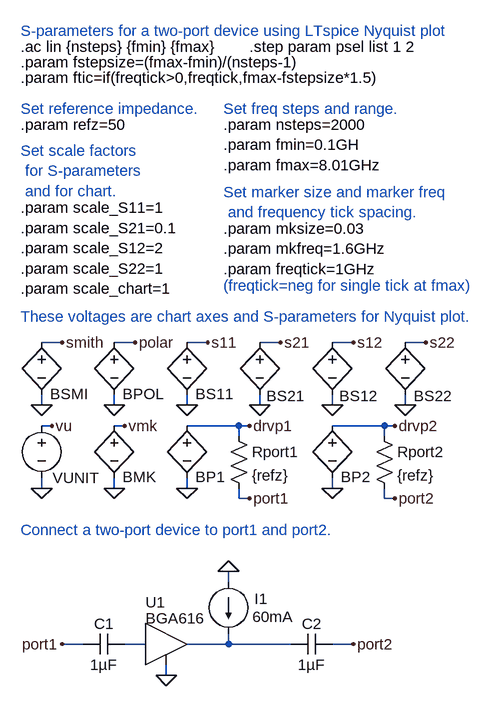
[diagram p0: schematic smith.asc]
smith.asc, the LTspice schematic file:
Version 4
SHEET 1 1520 4196
WIRE -240 2352 -272 2352
WIRE -128 2352 -160 2352
WIRE -16 2352 -48 2352
WIRE 96 2352 64 2352
WIRE 208 2352 176 2352
WIRE 320 2352 288 2352
WIRE -272 2448 -272 2432
WIRE -160 2448 -160 2432
WIRE -48 2448 -48 2432
WIRE 64 2448 64 2432
WIRE 176 2448 176 2432
WIRE 288 2448 288 2432
WIRE -256 2480 -272 2480
WIRE -144 2480 -160 2480
WIRE 32 2480 -48 2480
WIRE 48 2480 32 2480
WIRE 256 2480 176 2480
WIRE 272 2480 256 2480
WIRE 32 2496 32 2480
WIRE 256 2496 256 2480
WIRE -272 2576 -272 2560
WIRE -160 2576 -160 2560
WIRE -48 2576 -48 2560
WIRE 176 2576 176 2560
WIRE 32 2592 32 2576
WIRE 48 2592 32 2592
WIRE 256 2592 256 2576
WIRE 272 2592 256 2592
WIRE 16 2720 16 2704
WIRE -208 2816 -240 2816
WIRE -112 2816 -144 2816
WIRE 16 2816 16 2800
WIRE 16 2816 -48 2816
WIRE 112 2816 16 2816
WIRE 208 2816 176 2816
WIRE -80 2864 -80 2848
FLAG 48 2592 port1
FLAG 272 2592 port2
FLAG 48 2480 drvp1
FLAG 272 2480 drvp2
FLAG -272 2576 0
FLAG -48 2448 0
FLAG -16 2352 s11
FLAG 176 2448 0
FLAG 208 2352 s12
FLAG 64 2448 0
FLAG 96 2352 s21
FLAG 288 2448 0
FLAG 320 2352 s22
FLAG -160 2576 0
FLAG -144 2480 vmk
FLAG -48 2576 0
FLAG 176 2576 0
FLAG -256 2480 vu
FLAG 208 2816 port2
FLAG -240 2816 port1
FLAG -80 2864 0
FLAG 16 2704 0
FLAG -240 2352 smith
FLAG -272 2448 0
FLAG -128 2352 polar
FLAG -160 2448 0
SYMBOL voltage -272 2464 R0
WINDOW 0 17 96 Left 0
WINDOW 39 17 124 Left 0
SYMATTR InstName VUNIT
SYMATTR Value2 AC 1V 0
SYMATTR Value ""
SYMBOL res 240 2480 R0
SYMATTR InstName Rport2
SYMATTR Value {refz}
SYMBOL bv -48 2336 R0
WINDOW 0 13 95 Left 0
WINDOW 3 24 104 Invisible 0
SYMATTR InstName BS11
SYMATTR Value V=if(abs(psel-1),0,scale_S11*(2*V(port1)-V(drvp1))+V(vmk))
SYMBOL bv 176 2336 R0
WINDOW 0 11 98 Left 0
WINDOW 3 24 104 Invisible 0
SYMATTR InstName BS12
SYMATTR Value V=if(abs(psel-2),0,scale_S12*(2*V(port1)-V(drvp1))+V(vmk))
SYMBOL bv 64 2336 R0
WINDOW 0 10 98 Left 0
WINDOW 3 24 104 Invisible 0
SYMATTR InstName BS21
SYMATTR Value V=if(abs(psel-1),0,scale_S21*(2*V(port2)-V(drvp2))+V(vmk))
SYMBOL bv 288 2336 R0
WINDOW 0 13 98 Left 0
WINDOW 3 24 104 Invisible 0
SYMATTR InstName BS22
SYMATTR Value V=if(abs(psel-2),0,scale_S22*(2*V(port2)-V(drvp2))+V(vmk))
SYMBOL bv -160 2464 R0
WINDOW 0 13 95 Left 0
WINDOW 3 24 104 Invisible 0
SYMATTR InstName BMK
SYMATTR Value V=V(vu)*max(0,{mksize}) laplace=0.5*((1-((sqrt(-1)*2*pi*{mkfreq-fstepsize}/s)-1)/abs((sqrt(-1)*2*pi*{mkfreq-fstepsize}/s)-1)*((sqrt(-1)*2*pi*{mkfreq}/s)-1)/abs((sqrt(-1)*2*pi*{mkfreq}/s)-1))+sqrt(-1)*(1-((sqrt(-1)*2*pi*{mkfreq}/s)-1)/abs((sqrt(-1)*2*pi*{mkfreq}/s)-1)*((sqrt(-1)*2*pi*{mkfreq+fstepsize}/s)-1)/abs((sqrt(-1)*2*pi*{mkfreq+fstepsize}/s)-1)))-0.25*((1-sin((s/sqrt(-1))/{2*ftic})/abs(sin((s/sqrt(-1))/{2*ftic}))*sin((s/sqrt(-1)+{2*pi*fstepsize})/{2*ftic})/abs(sin((s/sqrt(-1)+{2*pi*fstepsize})/{2*ftic})))+sqrt(-1)*(1-sin((s/sqrt(-1))/{2*ftic})/abs(sin((s/sqrt(-1))/{2*ftic}))*sin((s/sqrt(-1)-{2*pi*fstepsize})/{2*ftic})/abs(sin((s/sqrt(-1)-{2*pi*fstepsize})/{2*ftic}))))
SYMBOL res 16 2480 R0
SYMATTR InstName Rport1
SYMATTR Value {refz}
SYMBOL bv -48 2464 R0
WINDOW 0 13 95 Left 0
WINDOW 3 24 104 Invisible 0
SYMATTR InstName BP1
SYMATTR Value V=if(abs({psel}-1),0V,V(vu))
SYMBOL bv 176 2464 R0
WINDOW 0 13 95 Left 0
WINDOW 3 24 104 Invisible 0
SYMATTR InstName BP2
SYMATTR Value V=if(abs({psel}-2),0V,V(vu))
SYMBOL bv -272 2336 R0
WINDOW 0 13 95 Left 0
WINDOW 3 24 104 Invisible 0
SYMATTR InstName BSMI
SYMATTR Value V=V(vu)*{scale_chart}*0.99999999999 laplace=(2-{psel})*(((cos((pi/36)*(s/(sqrt(-1)*2*pi)-{fmin})/({fstepsize}))+sqrt(-1)*sin((pi/36)*(s/(sqrt(-1)*2*pi)-{fmin})/({fstepsize})))*(3-abs((s/(sqrt(-1)*2*pi)-{fmin})/({fstepsize})-72)/((s/(sqrt(-1)*2*pi)-{fmin})/({fstepsize})-72))/4+(1+abs((s/(sqrt(-1)*2*pi)-{fmin})/({fstepsize})-72)/((s/(sqrt(-1)*2*pi)-{fmin})/({fstepsize})-72))/4)*(1-abs((s/(sqrt(-1)*2*pi)-{fmin})/({fstepsize})-144)/((s/(sqrt(-1)*2*pi)-{fmin})/({fstepsize})-144))/2-(1+abs((s/(sqrt(-1)*2*pi)-{fmin})/({fstepsize})-144)/((s/(sqrt(-1)*2*pi)-{fmin})/({fstepsize})-144))/2)+({psel}-1)*(((1-abs(cos((pi/36)*(s/(sqrt(-1)*2*pi)-{fmin})/({fstepsize}))))+sqrt(-1)*(1-sin((pi/36)*(s/(sqrt(-1)*2*pi)-{fmin})/({fstepsize})))*abs((s/(sqrt(-1)*2*pi)-{fmin})/({fstepsize})-17.5)/((s/(sqrt(-1)*2*pi)-{fmin})/({fstepsize})-17.5))*(1-abs((s/(sqrt(-1)*2*pi)-{fmin})/({fstepsize})-35.5)/((s/(sqrt(-1)*2*pi)-{fmin})/({fstepsize})-35.5))/2+sqrt(-1)*(1+abs((s/(sqrt(-1)*2*pi)-{fmin})/({fstepsize})-35.5)/((s/(sqrt(-1)*2*pi)-{fmin})/({fstepsize})-35.5))/2)
SYMBOL BGA616 -80 2752 R0
SYMATTR InstName U1
SYMBOL current 16 2720 R0
WINDOW 0 40 26 Left 0
WINDOW 3 37 54 Left 0
WINDOW 123 0 0 Left 0
WINDOW 39 0 0 Left 0
SYMATTR InstName I1
SYMATTR Value 60mA
SYMBOL cap -144 2800 R90
WINDOW 0 0 32 VBottom 0
WINDOW 3 32 32 VTop 0
SYMATTR InstName C1
SYMATTR Value 1µF
SYMBOL cap 176 2800 R90
WINDOW 0 0 32 VBottom 0
WINDOW 3 32 32 VTop 0
SYMATTR InstName C2
SYMATTR Value 1µF
SYMBOL bv -160 2336 R0
WINDOW 0 13 95 Left 0
WINDOW 3 24 104 Invisible 0
SYMATTR InstName BPOL
SYMATTR Value V=V(vu)*({scale_chart}/{psel}) laplace=(cos((pi/36)*(s/(sqrt(-1)*2*pi)-{fmin})/({fstepsize}))+sqrt(-1)*sin((pi/36)*(s/(sqrt(-1)*2*pi)-{fmin})/({fstepsize})))*(1-abs((s/(sqrt(-1)*2*pi)-{fmin})/({fstepsize})-72.5)/((s/(sqrt(-1)*2*pi)-{fmin})/({fstepsize})-72.5))/2-(1-abs((s/(sqrt(-1)*2*pi)-{fmin})/({fstepsize})-72.5)/((s/(sqrt(-1)*2*pi)-{fmin})/({fstepsize})-72.5)*abs((s/(sqrt(-1)*2*pi)-{fmin})/({fstepsize})-73.5)/((s/(sqrt(-1)*2*pi)-{fmin})/({fstepsize})-73.5))/2+sqrt(-1)*abs((s/(sqrt(-1)*2*pi)-{fmin})/({fstepsize})-75.5)/((s/(sqrt(-1)*2*pi)-{fmin})/({fstepsize})-75.5)*(1-abs((s/(sqrt(-1)*2*pi)-{fmin})/({fstepsize})-74.5)/((s/(sqrt(-1)*2*pi)-{fmin})/({fstepsize})-74.5)*abs((s/(sqrt(-1)*2*pi)-{fmin})/({fstepsize})-76.5)/((s/(sqrt(-1)*2*pi)-{fmin})/({fstepsize})-76.5))/2
TEXT -304 2640 Left 0 ;Connect a two-port device to port1 and port2.
TEXT -304 2312 Left 0 ;These voltages are chart axes and S-parameters for Nyquist plot.
TEXT -304 1920 Left 0 !.param fstepsize=(fmax-fmin)/(nsteps-1)
TEXT -304 1944 Left 0 !.param ftic=if(freqtick>0,freqtick,fmax-fstepsize*1.5)
TEXT 8 1992 Left 0 ;Set freq steps and range.
TEXT 8 2016 Left 0 !.param nsteps=2000\n.param fmin=0.1GH\n.param fmax=8.01GHz
TEXT -304 1992 Left 0 ;Set reference impedance.
TEXT -304 2016 Left 0 !.param refz=50
TEXT 8 2176 Left 0 !.param mksize=0.03\n.param mkfreq=1.6GHz\n.param freqtick=1GHz
TEXT 8 2120 Left 0 ;Set marker size and marker freq\n and frequency tick spacing.
TEXT 48 1896 Left 0 !.step param psel list 1 2
TEXT -304 1896 Left 0 !.ac lin {nsteps} {fmin} {fmax}
TEXT -304 1872 Left 0 ;S-parameters for a two-port device using LTspice Nyquist plot
TEXT -304 2144 Left 0 !.param scale_S11=1\n.param scale_S21=0.1\n.param scale_S12=2\n.param scale_S22=1\n.param scale_chart=1
TEXT 8 2264 Left 0 ;(freqtick=neg for single tick at fmax)
TEXT -304 2056 Left 0 ;Set scale factors\n for S-parameters\n and for chart.

The netlist it stands for:
* smith.asc
VUNIT vu 0 AC 1V 0
Rport2 drvp2 port2 {refz}
BS11 s11 0 V=if(abs(psel-1),0,scale_S11*(2*V(port1)-V(drvp1))+V(vmk))
BS12 s12 0 V=if(abs(psel-2),0,scale_S12*(2*V(port1)-V(drvp1))+V(vmk))
BS21 s21 0 V=if(abs(psel-1),0,scale_S21*(2*V(port2)-V(drvp2))+V(vmk))
BS22 s22 0 V=if(abs(psel-2),0,scale_S22*(2*V(port2)-V(drvp2))+V(vmk))
BMK vmk 0 V=V(vu)*max(0,{mksize}) laplace=0.5*((1-((sqrt(-1)*2*pi*{mkfreq-fstepsize}/s)-1)/abs((sqrt(-1)*2*pi*{mkfreq-fstepsize}/s)-1)*((sqrt(-1)*2*pi*{mkfreq}/s)-1)/abs((sqrt(-1)*2*pi*{mkfreq}/s)-1))+sqrt(-1)*(1-((sqrt(-1)*2*pi*{mkfreq}/s)-1)/abs((sqrt(-1)*2*pi*{mkfreq}/s)-1)*((sqrt(-1)*2*pi*{mkfreq+fstepsize}/s)-1)/abs((sqrt(-1)*2*pi*{mkfreq+fstepsize}/s)-1)))-0.25*((1-sin((s/sqrt(-1))/{2*ftic})/abs(sin((s/sqrt(-1))/{2*ftic}))*sin((s/sqrt(-1)+{2*pi*fstepsize})/{2*ftic})/abs(sin((s/sqrt(-1)+{2*pi*fstepsize})/{2*ftic})))+sqrt(-1)*(1-sin((s/sqrt(-1))/{2*ftic})/abs(sin((s/sqrt(-1))/{2*ftic}))*sin((s/sqrt(-1)-{2*pi*fstepsize})/{2*ftic})/abs(sin((s/sqrt(-1)-{2*pi*fstepsize})/{2*ftic}))))
Rport1 drvp1 port1 {refz}
BP1 drvp1 0 V=if(abs({psel}-1),0V,V(vu))
BP2 drvp2 0 V=if(abs({psel}-2),0V,V(vu))
BSMI smith 0 V=V(vu)*{scale_chart}*0.99999999999 laplace=(2-{psel})*(((cos((pi/36)*(s/(sqrt(-1)*2*pi)-{fmin})/({fstepsize}))+sqrt(-1)*sin((pi/36)*(s/(sqrt(-1)*2*pi)-{fmin})/({fstepsize})))*(3-abs((s/(sqrt(-1)*2*pi)-{fmin})/({fstepsize})-72)/((s/(sqrt(-1)*2*pi)-{fmin})/({fstepsize})-72))/4+(1+abs((s/(sqrt(-1)*2*pi)-{fmin})/({fstepsize})-72)/((s/(sqrt(-1)*2*pi)-{fmin})/({fstepsize})-72))/4)*(1-abs((s/(sqrt(-1)*2*pi)-{fmin})/({fstepsize})-144)/((s/(sqrt(-1)*2*pi)-{fmin})/({fstepsize})-144))/2-(1+abs((s/(sqrt(-1)*2*pi)-{fmin})/({fstepsize})-144)/((s/(sqrt(-1)*2*pi)-{fmin})/({fstepsize})-144))/2)+({psel}-1)*(((1-abs(cos((pi/36)*(s/(sqrt(-1)*2*pi)-{fmin})/({fstepsize}))))+sqrt(-1)*(1-sin((pi/36)*(s/(sqrt(-1)*2*pi)-{fmin})/({fstepsize})))*abs((s/(sqrt(-1)*2*pi)-{fmin})/({fstepsize})-17.5)/((s/(sqrt(-1)*2*pi)-{fmin})/({fstepsize})-17.5))*(1-abs((s/(sqrt(-1)*2*pi)-{fmin})/({fstepsize})-35.5)/((s/(sqrt(-1)*2*pi)-{fmin})/({fstepsize})-35.5))/2+sqrt(-1)*(1+abs((s/(sqrt(-1)*2*pi)-{fmin})/({fstepsize})-35.5)/((s/(sqrt(-1)*2*pi)-{fmin})/({fstepsize})-35.5))/2)
XU1 N001 N002 0 BGA616  ; pins inp out ref
I1 0 N002 60mA
C1 N001 port1 1µF
C2 port2 N002 1µF
BPOL polar 0 V=V(vu)*({scale_chart}/{psel}) laplace=(cos((pi/36)*(s/(sqrt(-1)*2*pi)-{fmin})/({fstepsize}))+sqrt(-1)*sin((pi/36)*(s/(sqrt(-1)*2*pi)-{fmin})/({fstepsize})))*(1-abs((s/(sqrt(-1)*2*pi)-{fmin})/({fstepsize})-72.5)/((s/(sqrt(-1)*2*pi)-{fmin})/({fstepsize})-72.5))/2-(1-abs((s/(sqrt(-1)*2*pi)-{fmin})/({fstepsize})-72.5)/((s/(sqrt(-1)*2*pi)-{fmin})/({fstepsize})-72.5)*abs((s/(sqrt(-1)*2*pi)-{fmin})/({fstepsize})-73.5)/((s/(sqrt(-1)*2*pi)-{fmin})/({fstepsize})-73.5))/2+sqrt(-1)*abs((s/(sqrt(-1)*2*pi)-{fmin})/({fstepsize})-75.5)/((s/(sqrt(-1)*2*pi)-{fmin})/({fstepsize})-75.5)*(1-abs((s/(sqrt(-1)*2*pi)-{fmin})/({fstepsize})-74.5)/((s/(sqrt(-1)*2*pi)-{fmin})/({fstepsize})-74.5)*abs((s/(sqrt(-1)*2*pi)-{fmin})/({fstepsize})-76.5)/((s/(sqrt(-1)*2*pi)-{fmin})/({fstepsize})-76.5))/2
* Connect a two-port device to port1 and port2.
* These voltages are chart axes and S-parameters for Nyquist plot.
.param fstepsize=(fmax-fmin)/(nsteps-1)
.param ftic=if(freqtick>0,freqtick,fmax-fstepsize*1.5)
* Set freq steps and range.
.param nsteps=2000
.param fmin=0.1GH
.param fmax=8.01GHz
* Set reference impedance.
.param refz=50
.param mksize=0.03
.param mkfreq=1.6GHz
.param freqtick=1GHz
* Set marker size and marker freq
*  and frequency tick spacing.
.step param psel list 1 2
.ac lin {nsteps} {fmin} {fmax}
* S-parameters for a two-port device using LTspice Nyquist plot
.param scale_S11=1
.param scale_S21=0.1
.param scale_S12=2
.param scale_S22=1
.param scale_chart=1
* (freqtick=neg for single tick at fmax)
* Set scale factors
*  for S-parameters
*  and for chart.
.lib BGA616.SUB
.backanno
.end